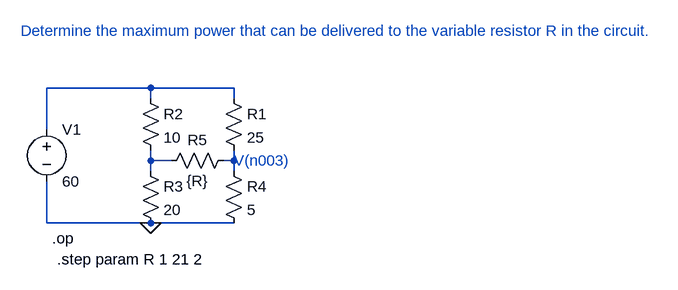
[diagram p0: schematic Draft1.asc]
Draft1.asc, the LTspice schematic file:
Version 4
SHEET 1 900 680
WIRE 112 144 -48 144
WIRE 240 144 112 144
WIRE 112 160 112 144
WIRE 240 160 240 144
WIRE -48 208 -48 144
WIRE 112 256 112 240
WIRE 144 256 112 256
WIRE 240 256 240 240
WIRE 240 256 224 256
WIRE 112 272 112 256
WIRE 240 272 240 256
WIRE -48 352 -48 288
WIRE 112 352 -48 352
WIRE 240 352 112 352
FLAG 112 352 0
SYMBOL Res 224 144 R0
SYMATTR InstName R1
SYMATTR Value 25
SYMBOL Res 96 144 R0
SYMATTR InstName R2
SYMATTR Value 10
SYMBOL Res 96 256 R0
SYMATTR InstName R3
SYMATTR Value 20
SYMBOL Res 224 256 R0
SYMATTR InstName R4
SYMATTR Value 5
SYMBOL Res 240 240 R90
WINDOW 0 0 56 VBottom 2
WINDOW 3 32 56 VTop 2
SYMATTR InstName R5
SYMATTR Value {R}
SYMBOL Voltage -48 192 R0
SYMATTR InstName V1
SYMATTR Value 60
TEXT -88 56 Left 2 ;Determine the maximum power that can be delivered to the variable resistor R in the circuit.
TEXT -40 376 Left 2 !.op
TEXT -32 408 Left 2 !.step param R 1 21 2
TEXT 240 256 Left 2 ;V(n003)

The netlist it stands for:
* Draft1.asc
R1 N001 N003 25
R2 N001 N002 10
R3 N002 0 20
R4 N003 0 5
R5 N003 N002 {R}
V1 N001 0 60
* Determine the maximum power that can be delivered to the variable resistor R in the circuit.
.op
.step param R 1 21 2
* V(n003)
.backanno
.end